# Altium schematic sheet megabit rev2 top.SchDoc: Megabit Revision 2 Top-Level
size A4; DrawnBy: Megabit Team; DocumentNumber: 1; Revision: 1; SheetNumber: 1; SheetTotal: 3
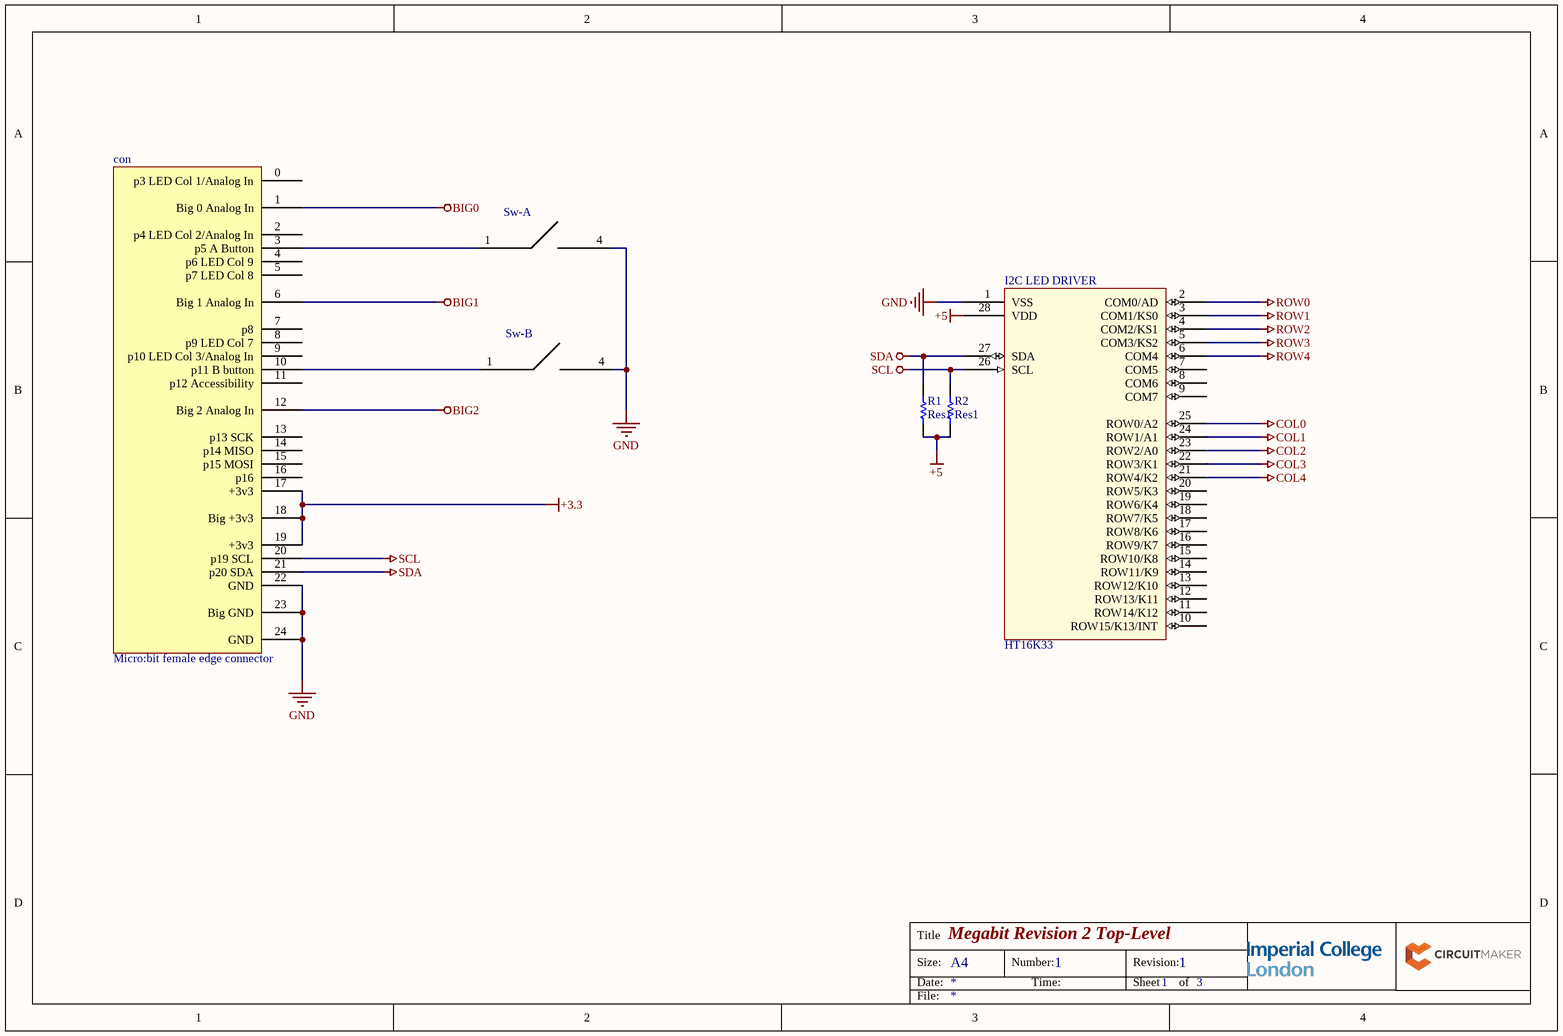
[diagram p0: megabit rev2 top.SchDoc]

## Parts
con  Micro:bit female edge connector  [PCBComponent_1 - duplicate]
I2C_LED_DRIVER  HT16K33  [PCB-otwcc1b496jwxezlenqc-1]
R1  Res1  [PCB-3613466-1]
R2  Res1  [PCB-3613466-1]
Sw-A  TE Connectivity (Tyco Electronics) / ALCOSWITCH FSM4JSMATR  [PCB-1274972-1]  (value not drawn)
Sw-B  TE Connectivity (Tyco Electronics) / ALCOSWITCH FSM4JSMATR  [PCB-1274972-1]  (value not drawn)

## Nets
+3.3: con.17(+3v3) con.18(Big_+3v3) con.19(+3v3)
+5: I2C_LED_DRIVER.28(VDD) R1.1 R2.1
BIG0: con.1(Big_0_Analog_In)
BIG1: con.6(Big_1_Analog_In)
BIG2: con.12(Big_2_Analog_In)
COL0: I2C_LED_DRIVER.25(ROW0/A2)
COL1: I2C_LED_DRIVER.24(ROW1/A1)
COL2: I2C_LED_DRIVER.23(ROW2/A0)
COL3: I2C_LED_DRIVER.22(ROW3/K1)
COL4: I2C_LED_DRIVER.21(ROW4/K2)
GND: con.22(GND) con.23(Big_GND) con.24(GND) I2C_LED_DRIVER.1(VSS) Sw-A.4 Sw-B.4
ROW0: I2C_LED_DRIVER.2(COM0/AD)
ROW1: I2C_LED_DRIVER.3(COM1/KS0)
ROW2: I2C_LED_DRIVER.4(COM2/KS1)
ROW3: I2C_LED_DRIVER.5(COM3/KS2)
ROW4: I2C_LED_DRIVER.6(COM4)
SCL: con.20(p19_SCL) I2C_LED_DRIVER.26(SCL) R2.2
SDA: con.21(p20_SDA) I2C_LED_DRIVER.27(SDA) R1.2
Netcon_3: con.3(p5_A_Button) Sw-A.1
Netcon_10: con.10(p11_B_button) Sw-B.1

Not connected (* = marked no-connect by the designer): con 0(p3_LED_Col_1/Analog_In) 2(p4_LED_Col_2/Analog_In) 4(p6_LED_Col_9) 5(p7_LED_Col_8) 7(p8) 8(p9_LED_Col_7) 9(p10_LED_Col_3/Analog_In) 11(p12_Accessibility) 13(p13_SCK) 14(p14_MISO) 15(p15_MOSI) 16(p16); I2C_LED_DRIVER 7(COM5) 8(COM6) 9(COM7) 10(ROW15/K13/INT) 11(ROW14/K12) 12(ROW13/K11) 13(ROW12/K10) 14(ROW11/K9) 15(ROW10/K8) 16(ROW9/K7) 17(ROW8/K6) 18(ROW7/K5) 19(ROW6/K4) 20(ROW5/K3)

## Notes on the sheet
- Title
- Size:
- Date:
- A4
- Number:
- Time:
- Revision:
- Sheet
- of
- File:

## Library data of the parts
con = CMP-mom7rix79jkpy4z4w6go-14: http://www.dgyuliang.net/html/279.html; CustomComponentID: mom7rix79jkpy4z4w6go
I2C_LED_DRIVER = CMP-58709250411787b7-2: 3M(TM) Stikit(TM) Gold Disc Roll, 01427, 5 in, P100A, 125 discs per roll, 10 rolls per case; REACH SVHC Compliance: No SVHC
R1 R2 = CMP-b15c796618a36e9b-3: Resistor 0.25W; OctopartID: b15c796618a36e9b
Sw-A Sw-B = CMP-1274972-10: SWITCH TACTILE SPST-NO 0.05A 24V; ELV Compliant: Compliant; Contacts Type: SPST; Lead-Free Status: Lead Free; Lifecycle Status: Active; OctopartID: 00c5cb91b7abdf02; RoHS: Compliant; Contact Plating: Silver; Mounting Style: PCB; REACH SVHC Compliance: No SVHC; Octopart Url: https://octopart.com/fsm4jsmatr-alco-1061461; Contact Material: Copper Alloy; Contact Current Rating: 0.05 A; Packaging: Tape & Reel (TR)